# Altium schematic sheet 7_PP0_PHY_CPU_88E1116.SchDoc
size 419 x 296 mm; Author: Serbinov O.A.; CompanyName: ELSICOM; DrawnBy: Serbinov O.A.; Engineer: Serbinov O.A.; Organization: Elsicom; Address1: Kirova avenue, 58; Address2: Tomsk; Address3: Russia 634012; DocumentNumber: 8; SheetNumber: 8; SheetTotal: 44; ProjectName: 48_PORTS
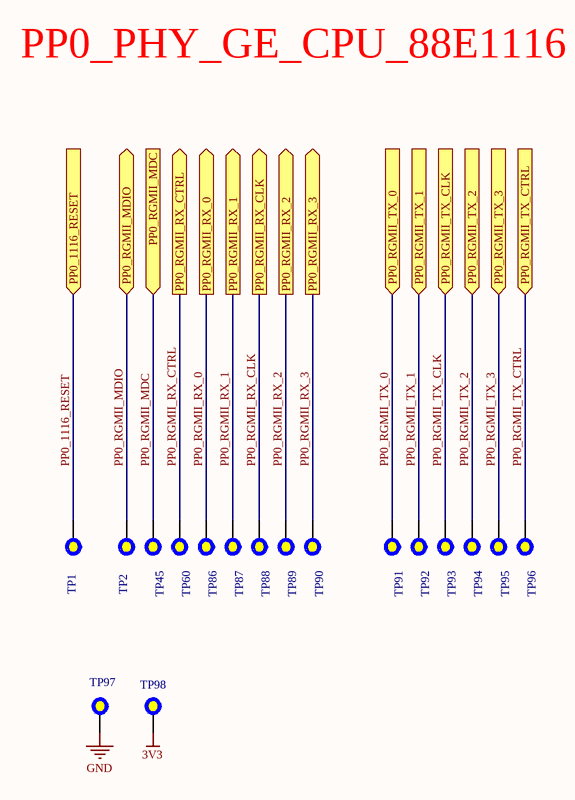
[diagram p0: 7_PP0_PHY_CPU_88E1116.SchDoc]

## Parts
TP1  Test Point 0.5mm pad  [Test Point 0.5mm]  (value not drawn)  (no BOM)
TP2  Test Point 0.5mm pad  [Test Point 0.5mm]  (value not drawn)  (no BOM)
TP45  Test Point 0.5mm pad  [Test Point 0.5mm]  (value not drawn)  (no BOM)
TP60  Test Point 0.5mm pad  [Test Point 0.5mm]  (value not drawn)  (no BOM)
TP86  Test Point 0.5mm pad  [Test Point 0.5mm]  (value not drawn)  (no BOM)
TP87  Test Point 0.5mm pad  [Test Point 0.5mm]  (value not drawn)  (no BOM)
TP88  Test Point 0.5mm pad  [Test Point 0.5mm]  (value not drawn)  (no BOM)
TP89  Test Point 0.5mm pad  [Test Point 0.5mm]  (value not drawn)  (no BOM)
TP90  Test Point 0.5mm pad  [Test Point 0.5mm]  (value not drawn)  (no BOM)
TP91  Test Point 0.5mm pad  [Test Point 0.5mm]  (value not drawn)  (no BOM)
TP92  Test Point 0.5mm pad  [Test Point 0.5mm]  (value not drawn)  (no BOM)
TP93  Test Point 0.5mm pad  [Test Point 0.5mm]  (value not drawn)  (no BOM)
TP94  Test Point 0.5mm pad  [Test Point 0.5mm]  (value not drawn)  (no BOM)
TP95  Test Point 0.5mm pad  [Test Point 0.5mm]  (value not drawn)  (no BOM)
TP96  Test Point 0.5mm pad  [Test Point 0.5mm]  (value not drawn)  (no BOM)
TP97  Test Point 0.5mm pad  [Test Point 0.5mm]  (value not drawn)  (no BOM)
TP98  Test Point 0.5mm pad  [Test Point 0.5mm]  (value not drawn)  (no BOM)

## Ports
PP0_1116_RESET (in), PP0_RGMII_MDC (in), PP0_RGMII_MDIO (bidir), PP0_RGMII_RX_0 (out), PP0_RGMII_RX_1 (out), PP0_RGMII_RX_2 (out), PP0_RGMII_RX_3 (out), PP0_RGMII_RX_CLK (out), PP0_RGMII_RX_CTRL (out), PP0_RGMII_TX_0 (in), PP0_RGMII_TX_1 (in), PP0_RGMII_TX_2 (in), PP0_RGMII_TX_3 (in), PP0_RGMII_TX_CLK (in), PP0_RGMII_TX_CTRL (in)

## Nets
3V3: TP98.1
GND: TP97.1
PP0_1116_RESET: TP1.1 ; port PP0_1116_RESET
PP0_RGMII_MDC: TP45.1 ; port PP0_RGMII_MDC
PP0_RGMII_MDIO: TP2.1 ; port PP0_RGMII_MDIO
PP0_RGMII_RX_0: TP86.1 ; port PP0_RGMII_RX_0
PP0_RGMII_RX_1: TP87.1 ; port PP0_RGMII_RX_1
PP0_RGMII_RX_2: TP89.1 ; port PP0_RGMII_RX_2
PP0_RGMII_RX_3: TP90.1 ; port PP0_RGMII_RX_3
PP0_RGMII_RX_CLK: TP88.1 ; port PP0_RGMII_RX_CLK
PP0_RGMII_RX_CTRL: TP60.1 ; port PP0_RGMII_RX_CTRL
PP0_RGMII_TX_0: TP91.1 ; port PP0_RGMII_TX_0
PP0_RGMII_TX_1: TP92.1 ; port PP0_RGMII_TX_1
PP0_RGMII_TX_2: TP94.1 ; port PP0_RGMII_TX_2
PP0_RGMII_TX_3: TP95.1 ; port PP0_RGMII_TX_3
PP0_RGMII_TX_CLK: TP93.1 ; port PP0_RGMII_TX_CLK
PP0_RGMII_TX_CTRL: TP96.1 ; port PP0_RGMII_TX_CTRL

## Notes on the sheet
- PP0_PHY_GE_CPU_88E1116
- A3
- SIZE
- PROJECT
- SHEET
- OF
- Engineer: Oleg Serbinov